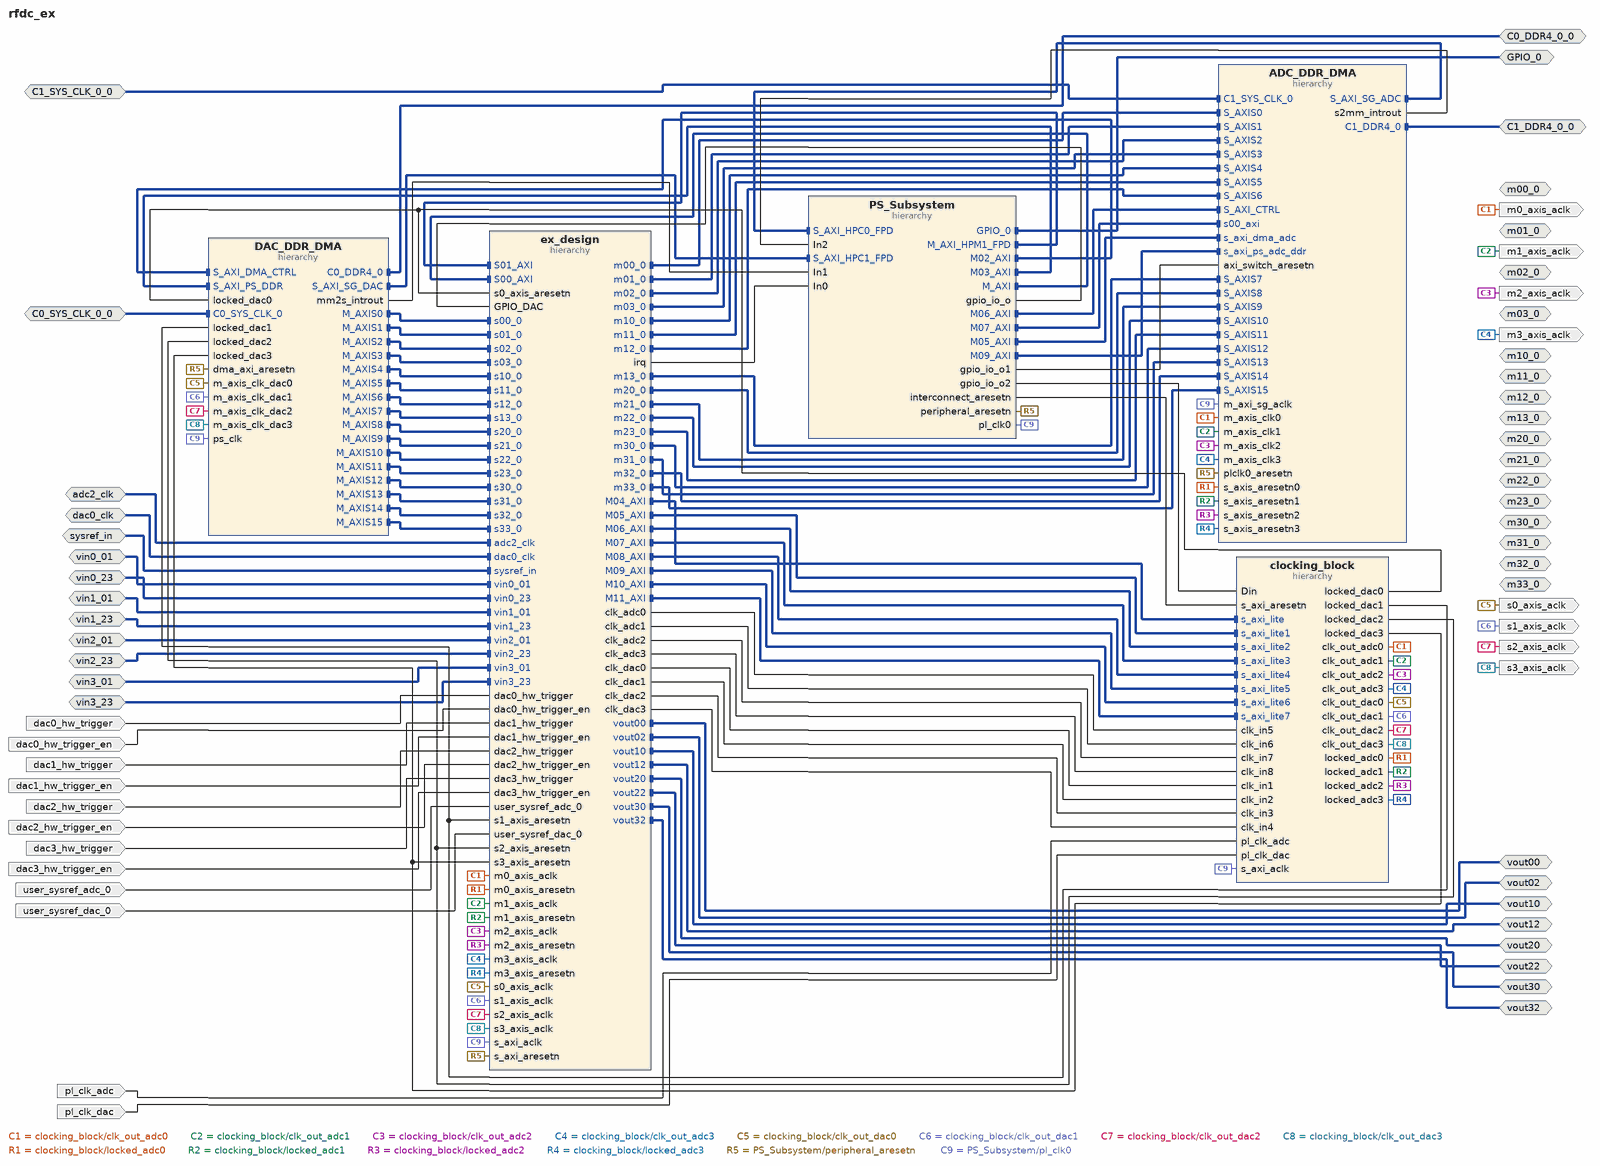
[diagram p0: block diagram of the top level]
# Vivado block design rfdc_ex, xczu48dr-fsvg1517-2-e, Vivado 2021.2
create_bd_design rfdc_ex

create_bd_intf_port -mode Slave -vlnv xilinx.com:display_usp_rf_data_converter:diff_pins_rtl:1.0 sysref_in
create_bd_intf_port -mode Slave -vlnv xilinx.com:interface:diff_clock_rtl:1.0 adc2_clk
set_property -dict {CONFIG.FREQ_HZ 245760000} [get_bd_intf_ports adc2_clk]
create_bd_intf_port -mode Slave -vlnv xilinx.com:interface:diff_clock_rtl:1.0 dac0_clk
set_property -dict {CONFIG.FREQ_HZ 245760000} [get_bd_intf_ports dac0_clk]
create_bd_intf_port -mode Slave -vlnv xilinx.com:interface:diff_analog_io_rtl:1.0 vin0_01
create_bd_intf_port -mode Slave -vlnv xilinx.com:interface:diff_analog_io_rtl:1.0 vin0_23
create_bd_intf_port -mode Slave -vlnv xilinx.com:interface:diff_analog_io_rtl:1.0 vin1_01
create_bd_intf_port -mode Slave -vlnv xilinx.com:interface:diff_analog_io_rtl:1.0 vin1_23
create_bd_intf_port -mode Slave -vlnv xilinx.com:interface:diff_analog_io_rtl:1.0 vin2_01
create_bd_intf_port -mode Slave -vlnv xilinx.com:interface:diff_analog_io_rtl:1.0 vin2_23
create_bd_intf_port -mode Slave -vlnv xilinx.com:interface:diff_analog_io_rtl:1.0 vin3_01
create_bd_intf_port -mode Slave -vlnv xilinx.com:interface:diff_analog_io_rtl:1.0 vin3_23
create_bd_intf_port -mode Master -vlnv xilinx.com:interface:diff_analog_io_rtl:1.0 vout00
create_bd_intf_port -mode Master -vlnv xilinx.com:interface:diff_analog_io_rtl:1.0 vout02
create_bd_intf_port -mode Master -vlnv xilinx.com:interface:diff_analog_io_rtl:1.0 vout10
create_bd_intf_port -mode Master -vlnv xilinx.com:interface:diff_analog_io_rtl:1.0 vout12
create_bd_intf_port -mode Master -vlnv xilinx.com:interface:diff_analog_io_rtl:1.0 vout20
create_bd_intf_port -mode Master -vlnv xilinx.com:interface:diff_analog_io_rtl:1.0 vout22
create_bd_intf_port -mode Master -vlnv xilinx.com:interface:diff_analog_io_rtl:1.0 vout30
create_bd_intf_port -mode Master -vlnv xilinx.com:interface:diff_analog_io_rtl:1.0 vout32
create_bd_intf_port -mode Master -vlnv xilinx.com:interface:axis_rtl:1.0 m00_0
create_bd_intf_port -mode Master -vlnv xilinx.com:interface:axis_rtl:1.0 m01_0
create_bd_intf_port -mode Master -vlnv xilinx.com:interface:axis_rtl:1.0 m02_0
create_bd_intf_port -mode Master -vlnv xilinx.com:interface:axis_rtl:1.0 m03_0
create_bd_intf_port -mode Master -vlnv xilinx.com:interface:axis_rtl:1.0 m10_0
create_bd_intf_port -mode Master -vlnv xilinx.com:interface:axis_rtl:1.0 m11_0
create_bd_intf_port -mode Master -vlnv xilinx.com:interface:axis_rtl:1.0 m12_0
create_bd_intf_port -mode Master -vlnv xilinx.com:interface:axis_rtl:1.0 m13_0
create_bd_intf_port -mode Master -vlnv xilinx.com:interface:axis_rtl:1.0 m20_0
create_bd_intf_port -mode Master -vlnv xilinx.com:interface:axis_rtl:1.0 m21_0
create_bd_intf_port -mode Master -vlnv xilinx.com:interface:axis_rtl:1.0 m22_0
create_bd_intf_port -mode Master -vlnv xilinx.com:interface:axis_rtl:1.0 m23_0
create_bd_intf_port -mode Master -vlnv xilinx.com:interface:axis_rtl:1.0 m30_0
create_bd_intf_port -mode Master -vlnv xilinx.com:interface:axis_rtl:1.0 m31_0
create_bd_intf_port -mode Master -vlnv xilinx.com:interface:axis_rtl:1.0 m32_0
create_bd_intf_port -mode Master -vlnv xilinx.com:interface:axis_rtl:1.0 m33_0
create_bd_intf_port -mode Master -vlnv xilinx.com:interface:gpio_rtl:1.0 GPIO_0
create_bd_intf_port -mode Slave -vlnv xilinx.com:interface:diff_clock_rtl:1.0 C0_SYS_CLK_0_0
set_property -dict {CONFIG.FREQ_HZ 299940000} [get_bd_intf_ports C0_SYS_CLK_0_0]
create_bd_intf_port -mode Master -vlnv xilinx.com:interface:ddr4_rtl:1.0 C0_DDR4_0_0
create_bd_intf_port -mode Slave -vlnv xilinx.com:interface:diff_clock_rtl:1.0 C1_SYS_CLK_0_0
set_property -dict {CONFIG.FREQ_HZ 299940000} [get_bd_intf_ports C1_SYS_CLK_0_0]
create_bd_intf_port -mode Master -vlnv xilinx.com:interface:ddr4_rtl:1.0 C1_DDR4_0_0
create_bd_port -dir I dac0_hw_trigger
create_bd_port -dir I dac0_hw_trigger_en
create_bd_port -dir I dac1_hw_trigger
create_bd_port -dir I dac1_hw_trigger_en
create_bd_port -dir I dac2_hw_trigger
create_bd_port -dir I dac2_hw_trigger_en
create_bd_port -dir I dac3_hw_trigger
create_bd_port -dir I dac3_hw_trigger_en
create_bd_port -dir O -type clk s0_axis_aclk
create_bd_port -dir O -type clk s1_axis_aclk
create_bd_port -dir O -type clk s2_axis_aclk
create_bd_port -dir O -type clk s3_axis_aclk
create_bd_port -dir O -type clk m0_axis_aclk
set_property -dict {CONFIG.ASSOCIATED_BUSIF m00_0:m01_0:m02_0:m03_0} [get_bd_ports m0_axis_aclk]
create_bd_port -dir O -type clk m1_axis_aclk
set_property -dict {CONFIG.ASSOCIATED_BUSIF m10_0:m11_0:m12_0:m13_0} [get_bd_ports m1_axis_aclk]
create_bd_port -dir O -type clk m2_axis_aclk
set_property -dict {CONFIG.ASSOCIATED_BUSIF m20_0:m21_0:m22_0:m23_0} [get_bd_ports m2_axis_aclk]
create_bd_port -dir O -type clk m3_axis_aclk
set_property -dict {CONFIG.ASSOCIATED_BUSIF m30_0:m31_0:m32_0:m33_0} [get_bd_ports m3_axis_aclk]
create_bd_port -dir I pl_clk_dac
create_bd_port -dir I user_sysref_dac_0
create_bd_port -dir I pl_clk_adc
create_bd_port -dir I user_sysref_adc_0

create_bd_cell -type hier ex_design
create_bd_cell -type hier clocking_block
create_bd_cell -type hier PS_Subsystem
create_bd_cell -type hier DAC_DDR_DMA
create_bd_cell -type hier ADC_DDR_DMA

# ---- hierarchy /ex_design ----
current_bd_instance /ex_design
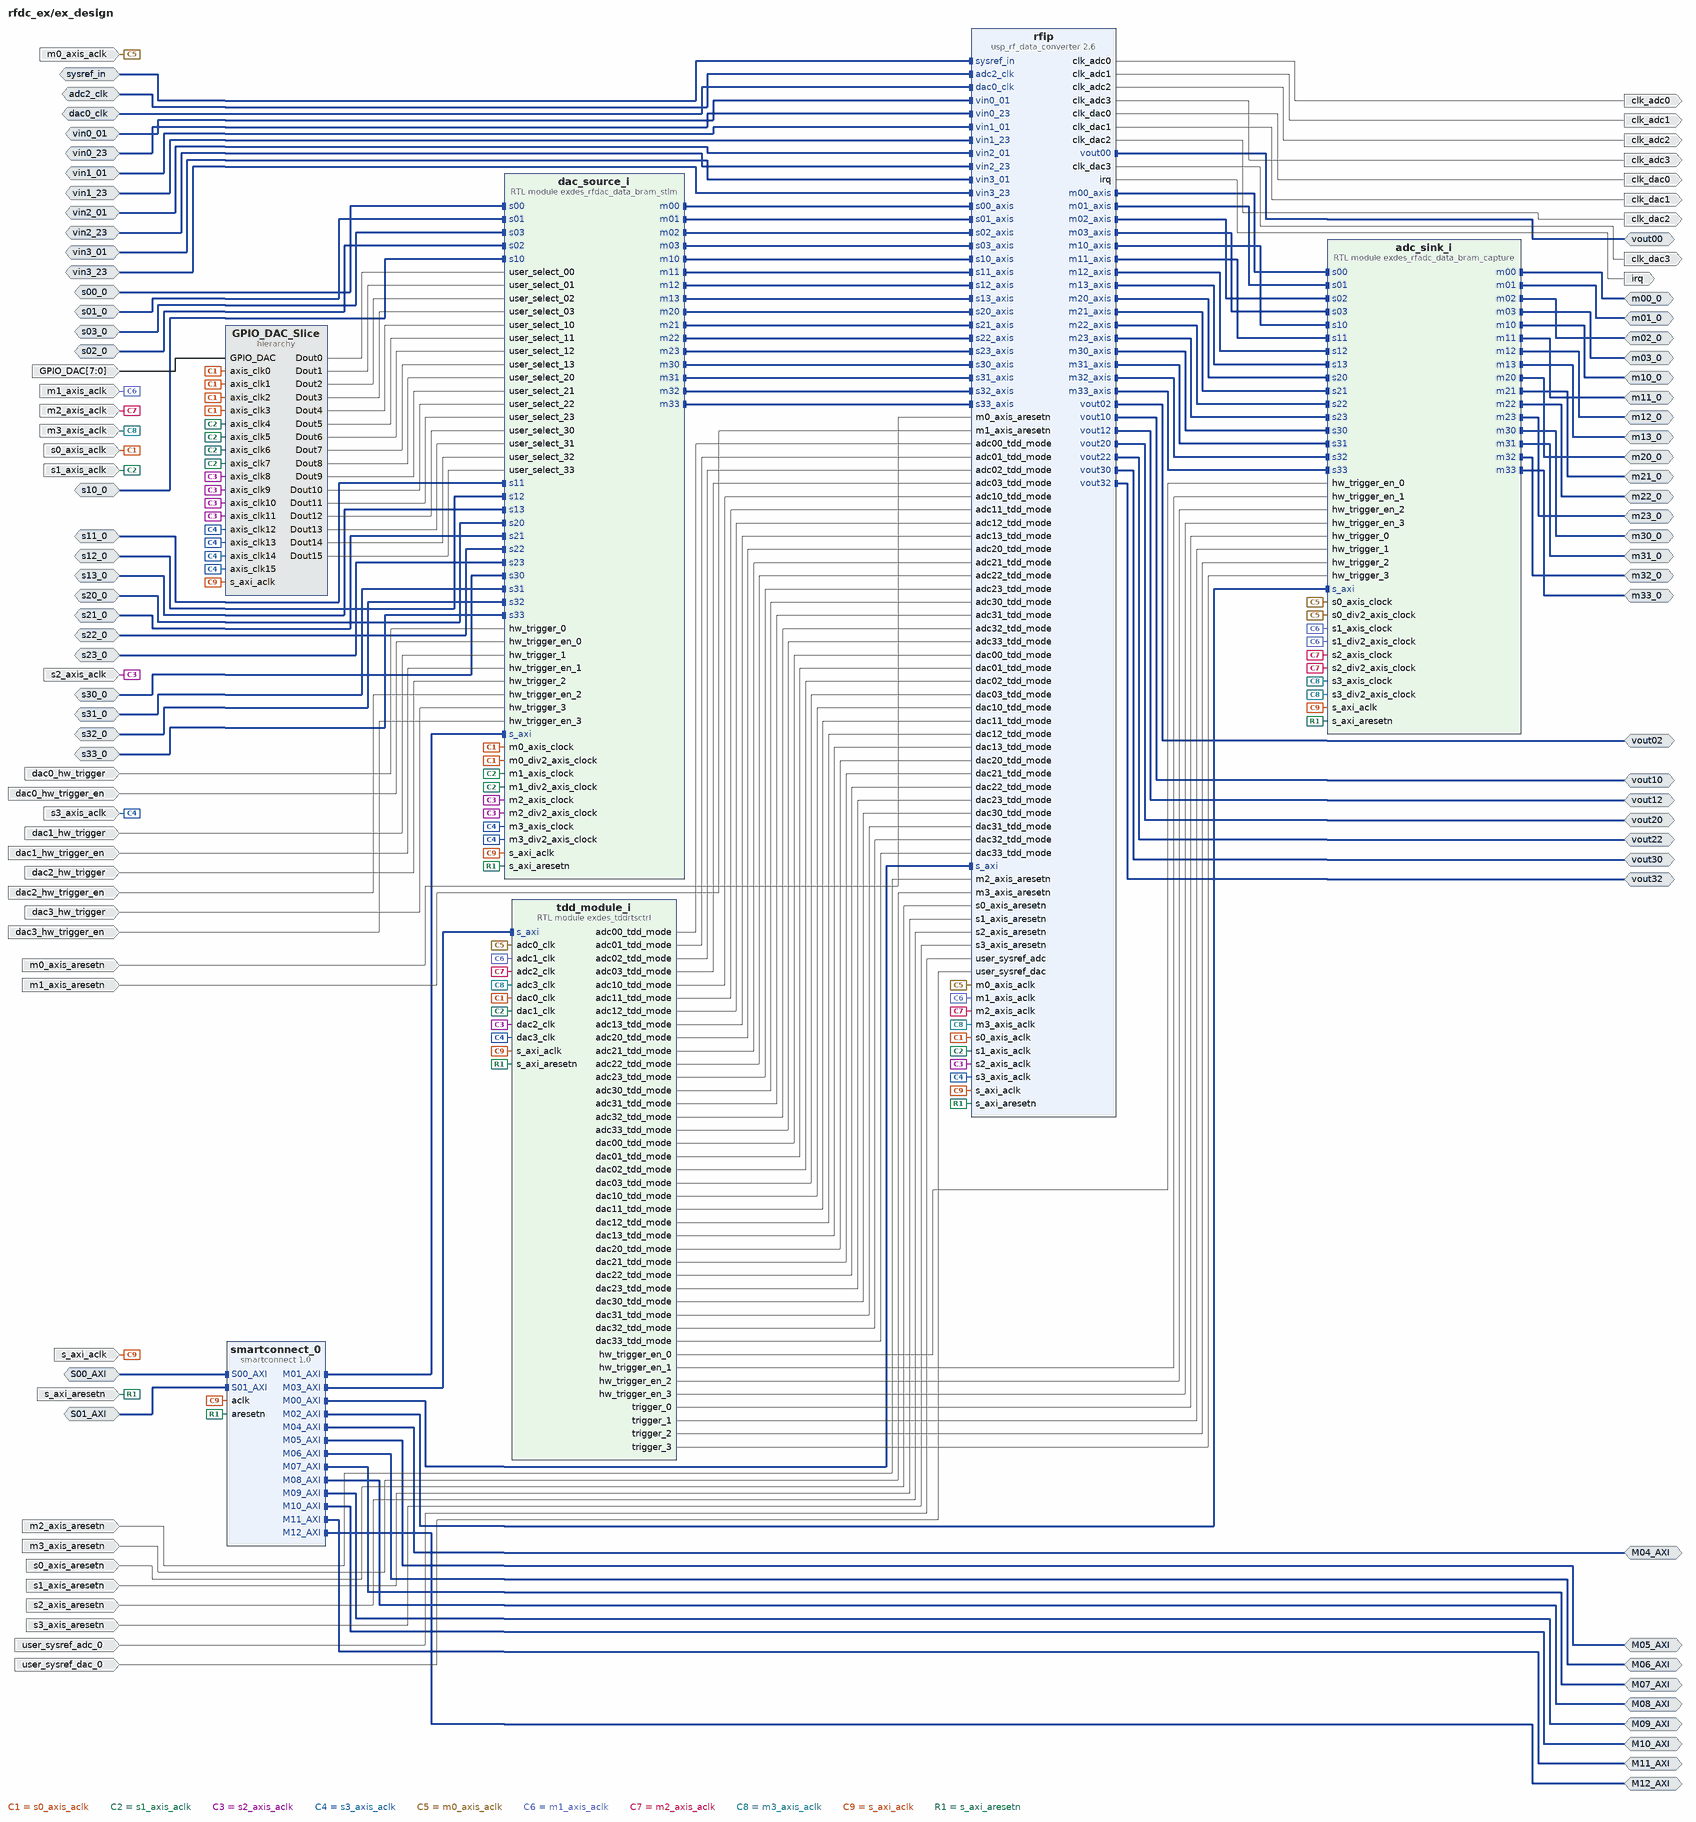
[diagram p1: block diagram inside /ex_design]
create_bd_intf_pin -mode Master -vlnv xilinx.com:interface:axis_rtl:1.0 m00_0
create_bd_intf_pin -mode Master -vlnv xilinx.com:interface:axis_rtl:1.0 m01_0
create_bd_intf_pin -mode Master -vlnv xilinx.com:interface:axis_rtl:1.0 m02_0
create_bd_intf_pin -mode Master -vlnv xilinx.com:interface:axis_rtl:1.0 m03_0
create_bd_intf_pin -mode Master -vlnv xilinx.com:interface:axis_rtl:1.0 m10_0
create_bd_intf_pin -mode Master -vlnv xilinx.com:interface:axis_rtl:1.0 m11_0
create_bd_intf_pin -mode Master -vlnv xilinx.com:interface:axis_rtl:1.0 m12_0
create_bd_intf_pin -mode Master -vlnv xilinx.com:interface:axis_rtl:1.0 m13_0
create_bd_intf_pin -mode Master -vlnv xilinx.com:interface:axis_rtl:1.0 m20_0
create_bd_intf_pin -mode Master -vlnv xilinx.com:interface:axis_rtl:1.0 m21_0
create_bd_intf_pin -mode Master -vlnv xilinx.com:interface:axis_rtl:1.0 m22_0
create_bd_intf_pin -mode Master -vlnv xilinx.com:interface:axis_rtl:1.0 m23_0
create_bd_intf_pin -mode Master -vlnv xilinx.com:interface:axis_rtl:1.0 m30_0
create_bd_intf_pin -mode Master -vlnv xilinx.com:interface:axis_rtl:1.0 m31_0
create_bd_intf_pin -mode Master -vlnv xilinx.com:interface:axis_rtl:1.0 m32_0
create_bd_intf_pin -mode Master -vlnv xilinx.com:interface:axis_rtl:1.0 m33_0
create_bd_intf_pin -mode Slave -vlnv xilinx.com:interface:axis_rtl:1.0 s00_0
create_bd_intf_pin -mode Slave -vlnv xilinx.com:interface:axis_rtl:1.0 s01_0
create_bd_intf_pin -mode Slave -vlnv xilinx.com:interface:axis_rtl:1.0 s03_0
create_bd_intf_pin -mode Slave -vlnv xilinx.com:interface:axis_rtl:1.0 s02_0
create_bd_intf_pin -mode Slave -vlnv xilinx.com:interface:axis_rtl:1.0 s10_0
create_bd_intf_pin -mode Slave -vlnv xilinx.com:interface:axis_rtl:1.0 s11_0
create_bd_intf_pin -mode Slave -vlnv xilinx.com:interface:axis_rtl:1.0 s12_0
create_bd_intf_pin -mode Slave -vlnv xilinx.com:interface:axis_rtl:1.0 s13_0
create_bd_intf_pin -mode Slave -vlnv xilinx.com:interface:axis_rtl:1.0 s20_0
create_bd_intf_pin -mode Slave -vlnv xilinx.com:interface:axis_rtl:1.0 s21_0
create_bd_intf_pin -mode Slave -vlnv xilinx.com:interface:axis_rtl:1.0 s22_0
create_bd_intf_pin -mode Slave -vlnv xilinx.com:interface:axis_rtl:1.0 s23_0
create_bd_intf_pin -mode Slave -vlnv xilinx.com:interface:axis_rtl:1.0 s30_0
create_bd_intf_pin -mode Slave -vlnv xilinx.com:interface:axis_rtl:1.0 s31_0
create_bd_intf_pin -mode Slave -vlnv xilinx.com:interface:axis_rtl:1.0 s32_0
create_bd_intf_pin -mode Slave -vlnv xilinx.com:interface:axis_rtl:1.0 s33_0
create_bd_intf_pin -mode Slave -vlnv xilinx.com:display_usp_rf_data_converter:diff_pins_rtl:1.0 sysref_in
create_bd_intf_pin -mode Slave -vlnv xilinx.com:interface:diff_clock_rtl:1.0 adc2_clk
create_bd_intf_pin -mode Slave -vlnv xilinx.com:interface:diff_clock_rtl:1.0 dac0_clk
create_bd_intf_pin -mode Slave -vlnv xilinx.com:interface:diff_analog_io_rtl:1.0 vin0_01
create_bd_intf_pin -mode Slave -vlnv xilinx.com:interface:diff_analog_io_rtl:1.0 vin0_23
create_bd_intf_pin -mode Slave -vlnv xilinx.com:interface:diff_analog_io_rtl:1.0 vin1_01
create_bd_intf_pin -mode Slave -vlnv xilinx.com:interface:diff_analog_io_rtl:1.0 vin1_23
create_bd_intf_pin -mode Slave -vlnv xilinx.com:interface:diff_analog_io_rtl:1.0 vin2_01
create_bd_intf_pin -mode Slave -vlnv xilinx.com:interface:diff_analog_io_rtl:1.0 vin2_23
create_bd_intf_pin -mode Slave -vlnv xilinx.com:interface:diff_analog_io_rtl:1.0 vin3_01
create_bd_intf_pin -mode Slave -vlnv xilinx.com:interface:diff_analog_io_rtl:1.0 vin3_23
create_bd_intf_pin -mode Master -vlnv xilinx.com:interface:diff_analog_io_rtl:1.0 vout00
create_bd_intf_pin -mode Master -vlnv xilinx.com:interface:diff_analog_io_rtl:1.0 vout02
create_bd_intf_pin -mode Master -vlnv xilinx.com:interface:diff_analog_io_rtl:1.0 vout10
create_bd_intf_pin -mode Master -vlnv xilinx.com:interface:diff_analog_io_rtl:1.0 vout12
create_bd_intf_pin -mode Master -vlnv xilinx.com:interface:diff_analog_io_rtl:1.0 vout20
create_bd_intf_pin -mode Master -vlnv xilinx.com:interface:diff_analog_io_rtl:1.0 vout22
create_bd_intf_pin -mode Master -vlnv xilinx.com:interface:diff_analog_io_rtl:1.0 vout30
create_bd_intf_pin -mode Master -vlnv xilinx.com:interface:diff_analog_io_rtl:1.0 vout32
create_bd_intf_pin -mode Master -vlnv xilinx.com:interface:aximm_rtl:1.0 M04_AXI
create_bd_intf_pin -mode Master -vlnv xilinx.com:interface:aximm_rtl:1.0 M05_AXI
create_bd_intf_pin -mode Master -vlnv xilinx.com:interface:aximm_rtl:1.0 M06_AXI
create_bd_intf_pin -mode Master -vlnv xilinx.com:interface:aximm_rtl:1.0 M07_AXI
create_bd_intf_pin -mode Master -vlnv xilinx.com:interface:aximm_rtl:1.0 M08_AXI
create_bd_intf_pin -mode Master -vlnv xilinx.com:interface:aximm_rtl:1.0 M09_AXI
create_bd_intf_pin -mode Master -vlnv xilinx.com:interface:aximm_rtl:1.0 M10_AXI
create_bd_intf_pin -mode Master -vlnv xilinx.com:interface:aximm_rtl:1.0 M11_AXI
create_bd_intf_pin -mode Slave -vlnv xilinx.com:interface:aximm_rtl:1.0 S00_AXI
create_bd_intf_pin -mode Slave -vlnv xilinx.com:interface:aximm_rtl:1.0 S01_AXI
create_bd_intf_pin -mode Master -vlnv xilinx.com:interface:aximm_rtl:1.0 M12_AXI
create_bd_pin -dir I -type clk s_axi_aclk
create_bd_pin -dir I -type rst s_axi_aresetn
create_bd_pin -dir I dac0_hw_trigger_en
create_bd_pin -dir I dac3_hw_trigger_en
create_bd_pin -dir I dac1_hw_trigger_en
create_bd_pin -dir I dac1_hw_trigger
create_bd_pin -dir I dac2_hw_trigger_en
create_bd_pin -dir I dac3_hw_trigger
create_bd_pin -dir I dac0_hw_trigger
create_bd_pin -dir I dac2_hw_trigger
create_bd_pin -dir O -type clk clk_dac0
create_bd_pin -dir I -type clk s0_axis_aclk
create_bd_pin -dir I -type rst s0_axis_aresetn
create_bd_pin -dir O -type clk clk_dac1
create_bd_pin -dir I -type clk s1_axis_aclk
create_bd_pin -dir I -type rst s1_axis_aresetn
create_bd_pin -dir O -type clk clk_dac2
create_bd_pin -dir I -type clk s2_axis_aclk
create_bd_pin -dir I -type rst s2_axis_aresetn
create_bd_pin -dir O -type clk clk_dac3
create_bd_pin -dir I -type clk s3_axis_aclk
create_bd_pin -dir I -type rst s3_axis_aresetn
create_bd_pin -dir O -type clk clk_adc0
create_bd_pin -dir I -type clk m0_axis_aclk
create_bd_pin -dir I -type rst m0_axis_aresetn
create_bd_pin -dir O -type clk clk_adc1
create_bd_pin -dir I -type clk m1_axis_aclk
create_bd_pin -dir I -type rst m1_axis_aresetn
create_bd_pin -dir O -type clk clk_adc2
create_bd_pin -dir I -type clk m2_axis_aclk
create_bd_pin -dir I -type rst m2_axis_aresetn
create_bd_pin -dir O -type clk clk_adc3
create_bd_pin -dir I -type clk m3_axis_aclk
create_bd_pin -dir I -type rst m3_axis_aresetn
create_bd_pin -dir O -type intr irq
create_bd_pin -dir I -from 7 -to 0 GPIO_DAC
create_bd_pin -dir I user_sysref_dac_0
create_bd_pin -dir I user_sysref_adc_0

create_bd_cell -type ip -vlnv xilinx.com:ip:smartconnect:1.0 smartconnect_0
set_property -dict {CONFIG.NUM_MI 13 CONFIG.NUM_SI 2} [get_bd_cells smartconnect_0]
create_bd_cell -type module -reference exdes_rfadc_data_bram_capture adc_sink_i
set_property -dict [list \
  CONFIG.axi_addr_top 19 \
  CONFIG.mem_size 262144 \
  CONFIG.use_div2_clk_0 0 \
  CONFIG.use_div2_clk_1 0 \
  CONFIG.use_div2_clk_2 0 \
  CONFIG.use_div2_clk_3 0 \
] [get_bd_cells adc_sink_i]
create_bd_cell -type module -reference exdes_rfdac_data_bram_stim dac_source_i
set_property -dict [list \
  CONFIG.axi_addr_top 19 \
  CONFIG.mem_size 262144 \
  CONFIG.use_div2_clk_0 0 \
  CONFIG.use_div2_clk_1 0 \
  CONFIG.use_div2_clk_2 0 \
  CONFIG.use_div2_clk_3 0 \
] [get_bd_cells dac_source_i]
create_bd_cell -type module -reference exdes_tddrtsctrl tdd_module_i
create_bd_cell -type ip -vlnv xilinx.com:ip:usp_rf_data_converter:2.6 rfip
set_property -dict [list \
  CONFIG.ADC0_Band 0 \
  CONFIG.ADC0_Clock_Dist 0 \
  CONFIG.ADC0_Clock_Source 2 \
  CONFIG.ADC0_Link_Coupling 0 \
  CONFIG.ADC0_Multi_Tile_Sync true \
  CONFIG.ADC0_Outclk_Freq 276.480 \
  CONFIG.ADC0_PLL_Enable true \
  CONFIG.ADC0_Refclk_Div 1 \
  CONFIG.ADC0_Refclk_Freq 245.760 \
  CONFIG.ADC0_Sampling_Rate 4.42368 \
  CONFIG.ADC1_Band 0 \
  CONFIG.ADC1_Clock_Dist 0 \
  CONFIG.ADC1_Clock_Source 2 \
  CONFIG.ADC1_Link_Coupling 0 \
  CONFIG.ADC1_Multi_Tile_Sync true \
  CONFIG.ADC1_Outclk_Freq 276.480 \
  CONFIG.ADC1_PLL_Enable true \
  CONFIG.ADC1_Refclk_Div 1 \
  CONFIG.ADC1_Refclk_Freq 245.760 \
  CONFIG.ADC1_Sampling_Rate 4.42368 \
  CONFIG.ADC224_En false \
  CONFIG.ADC225_En false \
  CONFIG.ADC226_En false \
  CONFIG.ADC227_En false \
  CONFIG.ADC2_Band 0 \
  CONFIG.ADC2_Clock_Dist 1 \
  CONFIG.ADC2_Clock_Source 2 \
  CONFIG.ADC2_Link_Coupling 0 \
  CONFIG.ADC2_Multi_Tile_Sync true \
  CONFIG.ADC2_Outclk_Freq 276.480 \
  CONFIG.ADC2_PLL_Enable true \
  CONFIG.ADC2_Refclk_Div 1 \
  CONFIG.ADC2_Refclk_Freq 245.760 \
  CONFIG.ADC2_Sampling_Rate 4.42368 \
  CONFIG.ADC3_Band 0 \
  CONFIG.ADC3_Clock_Dist 0 \
  CONFIG.ADC3_Clock_Source 2 \
  CONFIG.ADC3_Link_Coupling 0 \
  CONFIG.ADC3_Multi_Tile_Sync true \
  CONFIG.ADC3_Outclk_Freq 276.480 \
  CONFIG.ADC3_PLL_Enable true \
  CONFIG.ADC3_Refclk_Div 1 \
  CONFIG.ADC3_Refclk_Freq 245.760 \
  CONFIG.ADC3_Sampling_Rate 4.42368 \
  CONFIG.ADC_CalOpt_Mode00 2 \
  CONFIG.ADC_CalOpt_Mode02 2 \
  CONFIG.ADC_CalOpt_Mode10 2 \
  CONFIG.ADC_CalOpt_Mode12 2 \
  CONFIG.ADC_CalOpt_Mode20 2 \
  CONFIG.ADC_CalOpt_Mode22 2 \
  CONFIG.ADC_CalOpt_Mode30 2 \
  CONFIG.ADC_CalOpt_Mode32 2 \
  CONFIG.ADC_DSA_RTS false \
  CONFIG.ADC_Data_Type00 1 \
  CONFIG.ADC_Data_Type02 1 \
  CONFIG.ADC_Data_Type10 1 \
  CONFIG.ADC_Data_Type12 1 \
  CONFIG.ADC_Data_Type20 1 \
  CONFIG.ADC_Data_Type22 1 \
  CONFIG.ADC_Data_Type30 1 \
  CONFIG.ADC_Data_Type32 1 \
  CONFIG.ADC_Data_Width00 12 \
  CONFIG.ADC_Data_Width02 12 \
  CONFIG.ADC_Data_Width10 12 \
  CONFIG.ADC_Data_Width12 12 \
  CONFIG.ADC_Data_Width20 12 \
  CONFIG.ADC_Data_Width22 12 \
  CONFIG.ADC_Data_Width30 12 \
  CONFIG.ADC_Data_Width32 12 \
  CONFIG.ADC_Debug false \
  CONFIG.ADC_Decimation_Mode00 1 \
  CONFIG.ADC_Decimation_Mode02 1 \
  CONFIG.ADC_Decimation_Mode10 1 \
  CONFIG.ADC_Decimation_Mode12 1 \
  CONFIG.ADC_Decimation_Mode20 1 \
  CONFIG.ADC_Decimation_Mode22 1 \
  CONFIG.ADC_Decimation_Mode30 1 \
  CONFIG.ADC_Decimation_Mode32 1 \
  CONFIG.ADC_Dither00 true \
  CONFIG.ADC_Dither02 true \
  CONFIG.ADC_Dither10 true \
  CONFIG.ADC_Dither12 true \
  CONFIG.ADC_Dither20 true \
  CONFIG.ADC_Dither22 true \
  CONFIG.ADC_Dither30 true \
  CONFIG.ADC_Dither32 true \
  CONFIG.ADC_Mixer_Mode00 0 \
  CONFIG.ADC_Mixer_Mode02 0 \
  CONFIG.ADC_Mixer_Mode10 0 \
  CONFIG.ADC_Mixer_Mode12 0 \
  CONFIG.ADC_Mixer_Mode20 0 \
  CONFIG.ADC_Mixer_Mode22 0 \
  CONFIG.ADC_Mixer_Mode30 0 \
  CONFIG.ADC_Mixer_Mode32 0 \
  CONFIG.ADC_Mixer_Type00 2 \
  CONFIG.ADC_Mixer_Type01 2 \
  CONFIG.ADC_Mixer_Type02 2 \
  CONFIG.ADC_Mixer_Type03 2 \
  CONFIG.ADC_Mixer_Type10 2 \
  CONFIG.ADC_Mixer_Type11 2 \
  CONFIG.ADC_Mixer_Type12 2 \
  CONFIG.ADC_Mixer_Type13 2 \
  CONFIG.ADC_Mixer_Type20 2 \
  CONFIG.ADC_Mixer_Type21 2 \
  CONFIG.ADC_Mixer_Type22 2 \
  CONFIG.ADC_Mixer_Type23 2 \
  CONFIG.ADC_Mixer_Type30 2 \
  CONFIG.ADC_Mixer_Type31 2 \
  CONFIG.ADC_Mixer_Type32 2 \
  CONFIG.ADC_Mixer_Type33 2 \
  CONFIG.ADC_NCO_Freq00 0 \
  CONFIG.ADC_NCO_Freq02 0 \
  CONFIG.ADC_NCO_Freq10 0 \
  CONFIG.ADC_NCO_Freq12 0 \
  CONFIG.ADC_NCO_Freq20 0 \
  CONFIG.ADC_NCO_Freq22 0 \
  CONFIG.ADC_NCO_Freq30 0 \
  CONFIG.ADC_NCO_Freq32 0 \
  CONFIG.ADC_NCO_Phase00 0 \
  CONFIG.ADC_NCO_Phase02 0 \
  CONFIG.ADC_NCO_Phase10 0 \
  CONFIG.ADC_NCO_Phase12 0 \
  CONFIG.ADC_NCO_Phase20 0 \
  CONFIG.ADC_NCO_Phase22 0 \
  CONFIG.ADC_NCO_Phase30 0 \
  CONFIG.ADC_NCO_Phase32 0 \
  CONFIG.ADC_NCO_RTS false \
  CONFIG.ADC_Neg_Quadrature00 false \
  CONFIG.ADC_Neg_Quadrature02 false \
  CONFIG.ADC_Neg_Quadrature10 false \
  CONFIG.ADC_Neg_Quadrature12 false \
  CONFIG.ADC_Neg_Quadrature20 false \
  CONFIG.ADC_Neg_Quadrature22 false \
  CONFIG.ADC_Neg_Quadrature30 false \
  CONFIG.ADC_Neg_Quadrature32 false \
  CONFIG.ADC_Nyquist00 0 \
  CONFIG.ADC_Nyquist02 0 \
  CONFIG.ADC_Nyquist10 0 \
  CONFIG.ADC_Nyquist12 0 \
  CONFIG.ADC_Nyquist20 0 \
  CONFIG.ADC_Nyquist22 0 \
  CONFIG.ADC_Nyquist30 0 \
  CONFIG.ADC_Nyquist32 0 \
  CONFIG.ADC_OBS00 false \
  CONFIG.ADC_OBS02 false \
  CONFIG.ADC_OBS10 false \
  CONFIG.ADC_OBS12 false \
  CONFIG.ADC_OBS20 false \
  CONFIG.ADC_OBS22 false \
  CONFIG.ADC_OBS30 false \
  CONFIG.ADC_OBS32 false \
  CONFIG.ADC_RTS false \
  CONFIG.ADC_Slice00_Enable true \
  CONFIG.ADC_Slice02_Enable true \
  CONFIG.ADC_Slice10_Enable true \
  CONFIG.ADC_Slice12_Enable true \
  CONFIG.ADC_Slice20_Enable true \
  CONFIG.ADC_Slice22_Enable true \
  CONFIG.ADC_Slice30_Enable true \
  CONFIG.ADC_Slice32_Enable true \
  CONFIG.ADC_TDD_RTS00 1 \
  CONFIG.ADC_TDD_RTS02 1 \
  CONFIG.ADC_TDD_RTS10 1 \
  CONFIG.ADC_TDD_RTS12 1 \
  CONFIG.ADC_TDD_RTS20 1 \
  CONFIG.ADC_TDD_RTS22 1 \
  CONFIG.ADC_TDD_RTS30 1 \
  CONFIG.ADC_TDD_RTS32 1 \
  CONFIG.AMS_Factory_Var 0 \
  CONFIG.Analog_Detection 1 \
  CONFIG.Axiclk_Freq 57.5 \
  CONFIG.Calibration_Freeze false \
  CONFIG.Calibration_Time 10 \
  CONFIG.Clock_Forwarding false \
  CONFIG.Converter_Setup 1 \
  CONFIG.DAC0_Band 3 \
  CONFIG.DAC0_Clock_Dist 1 \
  CONFIG.DAC0_Clock_Source 4 \
  CONFIG.DAC0_Link_Coupling 0 \
  CONFIG.DAC0_Multi_Tile_Sync true \
  CONFIG.DAC0_Outclk_Freq 491.520 \
  CONFIG.DAC0_PLL_Enable true \
  CONFIG.DAC0_Refclk_Div 1 \
  CONFIG.DAC0_Refclk_Freq 245.760 \
  CONFIG.DAC0_Sampling_Rate 7.86432 \
  CONFIG.DAC0_VOP 32.0 \
  CONFIG.DAC1_Band 3 \
  CONFIG.DAC1_Clock_Source 4 \
  CONFIG.DAC1_Link_Coupling 0 \
  CONFIG.DAC1_Multi_Tile_Sync true \
  CONFIG.DAC1_Outclk_Freq 491.520 \
  CONFIG.DAC1_PLL_Enable true \
  CONFIG.DAC1_Refclk_Div 1 \
  CONFIG.DAC1_Refclk_Freq 245.760 \
  CONFIG.DAC1_Sampling_Rate 7.86432 \
  CONFIG.DAC1_VOP 32.0 \
  CONFIG.DAC228_En false \
  CONFIG.DAC229_En false \
  CONFIG.DAC230_En false \
  CONFIG.DAC231_En false \
  CONFIG.DAC2_Band 3 \
  CONFIG.DAC2_Clock_Dist 0 \
  CONFIG.DAC2_Clock_Source 4 \
  CONFIG.DAC2_Link_Coupling 0 \
  CONFIG.DAC2_Multi_Tile_Sync true \
  CONFIG.DAC2_Outclk_Freq 491.520 \
  CONFIG.DAC2_PLL_Enable true \
  CONFIG.DAC2_Refclk_Div 1 \
  CONFIG.DAC2_Refclk_Freq 245.760 \
  CONFIG.DAC2_Sampling_Rate 7.86432 \
  CONFIG.DAC2_VOP 32.0 \
  CONFIG.DAC3_Band 3 \
  CONFIG.DAC3_Clock_Source 4 \
  CONFIG.DAC3_Link_Coupling 0 \
  CONFIG.DAC3_Multi_Tile_Sync true \
  CONFIG.DAC3_Outclk_Freq 491.520 \
  CONFIG.DAC3_PLL_Enable true \
  CONFIG.DAC3_Refclk_Div 1 \
  CONFIG.DAC3_Refclk_Freq 245.760 \
  CONFIG.DAC3_Sampling_Rate 7.86432 \
  CONFIG.DAC3_VOP 32.0 \
  CONFIG.DAC_Data_Type00 0 \
  CONFIG.DAC_Data_Type02 0 \
  CONFIG.DAC_Data_Type10 0 \
  CONFIG.DAC_Data_Type12 0 \
  CONFIG.DAC_Data_Type20 0 \
  CONFIG.DAC_Data_Type22 0 \
  CONFIG.DAC_Data_Type30 0 \
  CONFIG.DAC_Data_Type32 0 \
  CONFIG.DAC_Data_Width00 16 \
  CONFIG.DAC_Data_Width01 16 \
  CONFIG.DAC_Data_Width02 16 \
  CONFIG.DAC_Data_Width03 16 \
  CONFIG.DAC_Data_Width10 16 \
  CONFIG.DAC_Data_Width11 16 \
  CONFIG.DAC_Data_Width12 16 \
  CONFIG.DAC_Data_Width13 16 \
  CONFIG.DAC_Data_Width20 16 \
  CONFIG.DAC_Data_Width21 16 \
  CONFIG.DAC_Data_Width22 16 \
  CONFIG.DAC_Data_Width23 16 \
  CONFIG.DAC_Data_Width30 16 \
  CONFIG.DAC_Data_Width31 16 \
  CONFIG.DAC_Data_Width32 16 \
  CONFIG.DAC_Data_Width33 16 \
  CONFIG.DAC_Debug false \
  CONFIG.DAC_Decoder_Mode00 0 \
  CONFIG.DAC_Decoder_Mode02 0 \
  CONFIG.DAC_Decoder_Mode10 0 \
  CONFIG.DAC_Decoder_Mode12 0 \
  CONFIG.DAC_Decoder_Mode20 0 \
  CONFIG.DAC_Decoder_Mode22 0 \
  CONFIG.DAC_Decoder_Mode30 0 \
  CONFIG.DAC_Decoder_Mode32 0 \
  CONFIG.DAC_Interpolation_Mode00 2 \
  CONFIG.DAC_Interpolation_Mode01 2 \
  CONFIG.DAC_Interpolation_Mode02 2 \
  CONFIG.DAC_Interpolation_Mode03 2 \
  CONFIG.DAC_Interpolation_Mode10 2 \
  CONFIG.DAC_Interpolation_Mode11 2 \
  CONFIG.DAC_Interpolation_Mode12 2 \
  CONFIG.DAC_Interpolation_Mode13 2 \
  CONFIG.DAC_Interpolation_Mode20 2 \
  CONFIG.DAC_Interpolation_Mode21 2 \
  CONFIG.DAC_Interpolation_Mode22 2 \
  CONFIG.DAC_Interpolation_Mode23 2 \
  CONFIG.DAC_Interpolation_Mode30 2 \
  CONFIG.DAC_Interpolation_Mode31 2 \
  CONFIG.DAC_Interpolation_Mode32 2 \
  CONFIG.DAC_Interpolation_Mode33 2 \
  CONFIG.DAC_Invsinc_Ctrl00 false \
  CONFIG.DAC_Invsinc_Ctrl02 false \
  CONFIG.DAC_Invsinc_Ctrl10 false \
  CONFIG.DAC_Invsinc_Ctrl12 false \
  CONFIG.DAC_Invsinc_Ctrl20 false \
  CONFIG.DAC_Invsinc_Ctrl22 false \
  CONFIG.DAC_Invsinc_Ctrl30 false \
  CONFIG.DAC_Invsinc_Ctrl32 false \
  CONFIG.DAC_Mixer_Mode00 0 \
  CONFIG.DAC_Mixer_Mode01 0 \
  CONFIG.DAC_Mixer_Mode02 0 \
  CONFIG.DAC_Mixer_Mode03 0 \
  CONFIG.DAC_Mixer_Mode10 0 \
  CONFIG.DAC_Mixer_Mode11 0 \
  CONFIG.DAC_Mixer_Mode12 0 \
  CONFIG.DAC_Mixer_Mode13 0 \
  CONFIG.DAC_Mixer_Mode20 0 \
  CONFIG.DAC_Mixer_Mode21 0 \
  CONFIG.DAC_Mixer_Mode22 0 \
  CONFIG.DAC_Mixer_Mode23 0 \
  CONFIG.DAC_Mixer_Mode30 0 \
  CONFIG.DAC_Mixer_Mode31 0 \
  CONFIG.DAC_Mixer_Mode32 0 \
  CONFIG.DAC_Mixer_Mode33 0 \
  CONFIG.DAC_Mixer_Type00 2 \
  CONFIG.DAC_Mixer_Type01 2 \
  CONFIG.DAC_Mixer_Type02 2 \
  CONFIG.DAC_Mixer_Type03 2 \
  CONFIG.DAC_Mixer_Type10 2 \
  CONFIG.DAC_Mixer_Type11 2 \
  CONFIG.DAC_Mixer_Type12 2 \
  CONFIG.DAC_Mixer_Type13 2 \
  CONFIG.DAC_Mixer_Type20 2 \
  CONFIG.DAC_Mixer_Type21 2 \
  CONFIG.DAC_Mixer_Type22 2 \
  CONFIG.DAC_Mixer_Type23 2 \
  CONFIG.DAC_Mixer_Type30 2 \
  CONFIG.DAC_Mixer_Type31 2 \
  CONFIG.DAC_Mixer_Type32 2 \
  CONFIG.DAC_Mixer_Type33 2 \
  CONFIG.DAC_Mode00 1 \
  CONFIG.DAC_Mode02 1 \
  CONFIG.DAC_Mode10 1 \
  CONFIG.DAC_Mode12 1 \
  CONFIG.DAC_Mode20 1 \
  CONFIG.DAC_Mode22 1 \
  CONFIG.DAC_Mode30 1 \
  CONFIG.DAC_Mode32 1 \
  CONFIG.DAC_NCO_Freq00 0.0 \
  CONFIG.DAC_NCO_Freq01 0.0 \
  CONFIG.DAC_NCO_Freq02 0.0 \
  CONFIG.DAC_NCO_Freq03 0.0 \
  CONFIG.DAC_NCO_Freq10 0.0 \
  CONFIG.DAC_NCO_Freq11 0.0 \
  CONFIG.DAC_NCO_Freq12 0.0 \
  CONFIG.DAC_NCO_Freq13 0.0 \
  CONFIG.DAC_NCO_Freq20 0.0 \
  CONFIG.DAC_NCO_Freq21 0.0 \
  CONFIG.DAC_NCO_Freq22 0.0 \
  CONFIG.DAC_NCO_Freq23 0.0 \
  CONFIG.DAC_NCO_Freq30 0.0 \
  CONFIG.DAC_NCO_Freq31 0.0 \
  CONFIG.DAC_NCO_Freq32 0.0 \
  CONFIG.DAC_NCO_Freq33 0.0 \
  CONFIG.DAC_NCO_Phase00 0 \
  CONFIG.DAC_NCO_Phase01 0 \
  CONFIG.DAC_NCO_Phase02 0 \
  CONFIG.DAC_NCO_Phase03 0 \
  CONFIG.DAC_NCO_Phase10 0 \
  CONFIG.DAC_NCO_Phase11 0 \
  CONFIG.DAC_NCO_Phase12 0 \
  CONFIG.DAC_NCO_Phase13 0 \
  CONFIG.DAC_NCO_Phase20 0 \
  CONFIG.DAC_NCO_Phase21 0 \
  CONFIG.DAC_NCO_Phase22 0 \
  CONFIG.DAC_NCO_Phase23 0 \
  CONFIG.DAC_NCO_Phase30 0 \
  CONFIG.DAC_NCO_Phase31 0 \
  CONFIG.DAC_NCO_Phase32 0 \
  CONFIG.DAC_NCO_Phase33 0 \
  CONFIG.DAC_NCO_RTS false \
  CONFIG.DAC_Neg_Quadrature00 false \
  CONFIG.DAC_Neg_Quadrature01 false \
  CONFIG.DAC_Neg_Quadrature02 false \
  CONFIG.DAC_Neg_Quadrature03 false \
  CONFIG.DAC_Neg_Quadrature10 false \
  CONFIG.DAC_Neg_Quadrature11 false \
  CONFIG.DAC_Neg_Quadrature12 false \
  CONFIG.DAC_Neg_Quadrature13 false \
  CONFIG.DAC_Neg_Quadrature20 false \
  CONFIG.DAC_Neg_Quadrature21 false \
  CONFIG.DAC_Neg_Quadrature22 false \
  CONFIG.DAC_Neg_Quadrature23 false \
  CONFIG.DAC_Neg_Quadrature30 false \
  CONFIG.DAC_Neg_Quadrature31 false \
  CONFIG.DAC_Neg_Quadrature32 false \
  CONFIG.DAC_Neg_Quadrature33 false \
  CONFIG.DAC_Nyquist00 0 \
  CONFIG.DAC_Nyquist02 0 \
  CONFIG.DAC_Nyquist10 0 \
  CONFIG.DAC_Nyquist12 0 \
  CONFIG.DAC_Nyquist20 0 \
  CONFIG.DAC_Nyquist22 0 \
  CONFIG.DAC_Nyquist30 0 \
  CONFIG.DAC_Nyquist32 0 \
  CONFIG.DAC_RTS false \
  CONFIG.DAC_Slice00_Enable true \
  CONFIG.DAC_Slice02_Enable true \
  CONFIG.DAC_Slice10_Enable true \
  CONFIG.DAC_Slice12_Enable true \
  CONFIG.DAC_Slice20_Enable true \
  CONFIG.DAC_Slice22_Enable true \
  CONFIG.DAC_Slice30_Enable true \
  CONFIG.DAC_Slice32_Enable true \
  CONFIG.DAC_TDD_RTS00 1 \
  CONFIG.DAC_TDD_RTS01 1 \
  CONFIG.DAC_TDD_RTS02 1 \
  CONFIG.DAC_TDD_RTS03 1 \
  CONFIG.DAC_TDD_RTS10 1 \
  CONFIG.DAC_TDD_RTS11 1 \
  CONFIG.DAC_TDD_RTS12 1 \
  CONFIG.DAC_TDD_RTS13 1 \
  CONFIG.DAC_TDD_RTS20 1 \
  CONFIG.DAC_TDD_RTS21 1 \
  CONFIG.DAC_TDD_RTS22 1 \
  CONFIG.DAC_TDD_RTS23 1 \
  CONFIG.DAC_TDD_RTS30 1 \
  CONFIG.DAC_TDD_RTS31 1 \
  CONFIG.DAC_TDD_RTS32 1 \
  CONFIG.DAC_TDD_RTS33 1 \
  CONFIG.DAC_VOP_Mode 1 \
  CONFIG.DAC_VOP_RTS false \
  CONFIG.PL_Clock_Freq 122.880 \
  CONFIG.PRESET None \
  CONFIG.RESERVED_3 110000 \
  CONFIG.RF_Analyzer 1 \
  CONFIG.VNC_Include_Fs2_Change true \
  CONFIG.VNC_Include_OIS_Change true \
  CONFIG.VNC_Testing false \
  CONFIG.disable_bg_cal_en 1 \
  CONFIG.mADC_Band 0 \
  CONFIG.mADC_Mixer_Type01 3 \
  CONFIG.mADC_Mixer_Type03 3 \
  CONFIG.mDAC_Band 0 \
  CONFIG.mDAC_Slice00_Enable false \
  CONFIG.mDAC_Slice02_Enable false \
  CONFIG.mDAC_VOP 20.0 \
  CONFIG.production_simulation 0 \
  CONFIG.tb_adc_fft true \
  CONFIG.tb_dac_fft true \
  CONFIG.use_bram 1 \
] [get_bd_cells rfip]
create_bd_cell -type hier GPIO_DAC_Slice

# ---- hierarchy /ex_design/GPIO_DAC_Slice ----
current_bd_instance /ex_design/GPIO_DAC_Slice
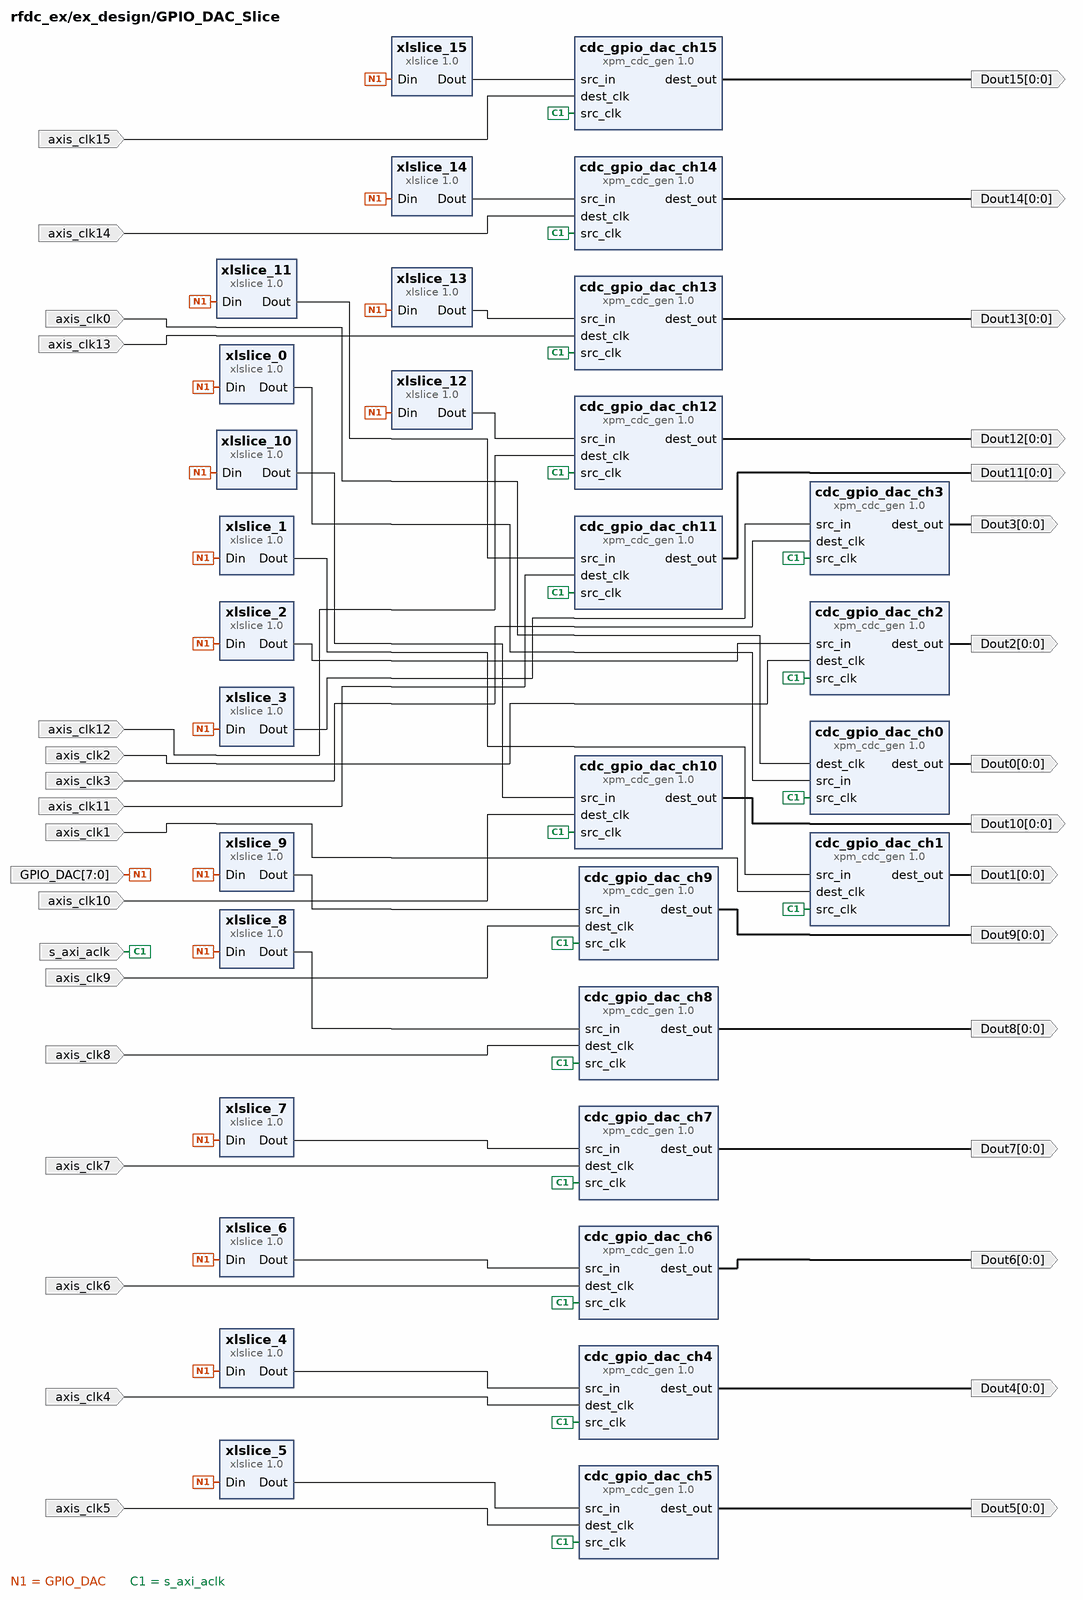
[diagram p2: block diagram inside /ex_design/GPIO_DAC_Slice]
create_bd_pin -dir I s_axi_aclk
create_bd_pin -dir O -from 0 -to 0 Dout0
create_bd_pin -dir O -from 0 -to 0 Dout1
create_bd_pin -dir O -from 0 -to 0 Dout2
create_bd_pin -dir O -from 0 -to 0 Dout3
create_bd_pin -dir O -from 0 -to 0 Dout4
create_bd_pin -dir O -from 0 -to 0 Dout5
create_bd_pin -dir O -from 0 -to 0 Dout6
create_bd_pin -dir O -from 0 -to 0 Dout7
create_bd_pin -dir O -from 0 -to 0 Dout8
create_bd_pin -dir O -from 0 -to 0 Dout9
create_bd_pin -dir O -from 0 -to 0 Dout10
create_bd_pin -dir O -from 0 -to 0 Dout11
create_bd_pin -dir O -from 0 -to 0 Dout12
create_bd_pin -dir O -from 0 -to 0 Dout13
create_bd_pin -dir O -from 0 -to 0 Dout14
create_bd_pin -dir O -from 0 -to 0 Dout15
create_bd_pin -dir I -from 7 -to 0 GPIO_DAC
create_bd_pin -dir I axis_clk0
create_bd_pin -dir I axis_clk1
create_bd_pin -dir I axis_clk2
create_bd_pin -dir I axis_clk3
create_bd_pin -dir I axis_clk4
create_bd_pin -dir I axis_clk5
create_bd_pin -dir I axis_clk6
create_bd_pin -dir I axis_clk7
create_bd_pin -dir I axis_clk8
create_bd_pin -dir I axis_clk9
create_bd_pin -dir I axis_clk10
create_bd_pin -dir I axis_clk11
create_bd_pin -dir I axis_clk12
create_bd_pin -dir I axis_clk13
create_bd_pin -dir I axis_clk14
create_bd_pin -dir I axis_clk15

create_bd_cell -type ip -vlnv xilinx.com:ip:xlslice:1.0 xlslice_0
set_property -dict {CONFIG.DIN_FROM 0 CONFIG.DIN_TO 0 CONFIG.DIN_WIDTH 8} [get_bd_cells xlslice_0]
create_bd_cell -type ip -vlnv xilinx.com:ip:xpm_cdc_gen:1.0 cdc_gpio_dac_ch0
set_property -dict {CONFIG.CDC_TYPE xpm_cdc_single CONFIG.WIDTH 1} [get_bd_cells cdc_gpio_dac_ch0]
create_bd_cell -type ip -vlnv xilinx.com:ip:xlslice:1.0 xlslice_1
set_property -dict {CONFIG.DIN_FROM 0 CONFIG.DIN_TO 0 CONFIG.DIN_WIDTH 8} [get_bd_cells xlslice_1]
create_bd_cell -type ip -vlnv xilinx.com:ip:xpm_cdc_gen:1.0 cdc_gpio_dac_ch1
set_property -dict {CONFIG.CDC_TYPE xpm_cdc_single CONFIG.WIDTH 1} [get_bd_cells cdc_gpio_dac_ch1]
create_bd_cell -type ip -vlnv xilinx.com:ip:xlslice:1.0 xlslice_2
set_property -dict {CONFIG.DIN_FROM 1 CONFIG.DIN_TO 1 CONFIG.DIN_WIDTH 8} [get_bd_cells xlslice_2]
create_bd_cell -type ip -vlnv xilinx.com:ip:xpm_cdc_gen:1.0 cdc_gpio_dac_ch2
set_property -dict {CONFIG.CDC_TYPE xpm_cdc_single CONFIG.WIDTH 1} [get_bd_cells cdc_gpio_dac_ch2]
create_bd_cell -type ip -vlnv xilinx.com:ip:xlslice:1.0 xlslice_3
set_property -dict {CONFIG.DIN_FROM 1 CONFIG.DIN_TO 1 CONFIG.DIN_WIDTH 8} [get_bd_cells xlslice_3]
create_bd_cell -type ip -vlnv xilinx.com:ip:xpm_cdc_gen:1.0 cdc_gpio_dac_ch3
set_property -dict {CONFIG.CDC_TYPE xpm_cdc_single CONFIG.WIDTH 1} [get_bd_cells cdc_gpio_dac_ch3]
create_bd_cell -type ip -vlnv xilinx.com:ip:xlslice:1.0 xlslice_4
set_property -dict {CONFIG.DIN_FROM 2 CONFIG.DIN_TO 2 CONFIG.DIN_WIDTH 8} [get_bd_cells xlslice_4]
create_bd_cell -type ip -vlnv xilinx.com:ip:xpm_cdc_gen:1.0 cdc_gpio_dac_ch4
set_property -dict {CONFIG.CDC_TYPE xpm_cdc_single CONFIG.WIDTH 1} [get_bd_cells cdc_gpio_dac_ch4]
create_bd_cell -type ip -vlnv xilinx.com:ip:xlslice:1.0 xlslice_5
set_property -dict {CONFIG.DIN_FROM 2 CONFIG.DIN_TO 2 CONFIG.DIN_WIDTH 8} [get_bd_cells xlslice_5]
create_bd_cell -type ip -vlnv xilinx.com:ip:xpm_cdc_gen:1.0 cdc_gpio_dac_ch5
set_property -dict {CONFIG.CDC_TYPE xpm_cdc_single CONFIG.WIDTH 1} [get_bd_cells cdc_gpio_dac_ch5]
create_bd_cell -type ip -vlnv xilinx.com:ip:xlslice:1.0 xlslice_6
set_property -dict {CONFIG.DIN_FROM 3 CONFIG.DIN_TO 3 CONFIG.DIN_WIDTH 8} [get_bd_cells xlslice_6]
create_bd_cell -type ip -vlnv xilinx.com:ip:xpm_cdc_gen:1.0 cdc_gpio_dac_ch6
set_property -dict {CONFIG.CDC_TYPE xpm_cdc_single CONFIG.WIDTH 1} [get_bd_cells cdc_gpio_dac_ch6]
create_bd_cell -type ip -vlnv xilinx.com:ip:xlslice:1.0 xlslice_7
set_property -dict {CONFIG.DIN_FROM 3 CONFIG.DIN_TO 3 CONFIG.DIN_WIDTH 8} [get_bd_cells xlslice_7]
create_bd_cell -type ip -vlnv xilinx.com:ip:xpm_cdc_gen:1.0 cdc_gpio_dac_ch7
set_property -dict {CONFIG.CDC_TYPE xpm_cdc_single CONFIG.WIDTH 1} [get_bd_cells cdc_gpio_dac_ch7]
create_bd_cell -type ip -vlnv xilinx.com:ip:xlslice:1.0 xlslice_8
set_property -dict {CONFIG.DIN_FROM 4 CONFIG.DIN_TO 4 CONFIG.DIN_WIDTH 8} [get_bd_cells xlslice_8]
create_bd_cell -type ip -vlnv xilinx.com:ip:xpm_cdc_gen:1.0 cdc_gpio_dac_ch8
set_property -dict {CONFIG.CDC_TYPE xpm_cdc_single CONFIG.WIDTH 1} [get_bd_cells cdc_gpio_dac_ch8]
create_bd_cell -type ip -vlnv xilinx.com:ip:xlslice:1.0 xlslice_9
set_property -dict {CONFIG.DIN_FROM 4 CONFIG.DIN_TO 4 CONFIG.DIN_WIDTH 8} [get_bd_cells xlslice_9]
create_bd_cell -type ip -vlnv xilinx.com:ip:xpm_cdc_gen:1.0 cdc_gpio_dac_ch9
set_property -dict {CONFIG.CDC_TYPE xpm_cdc_single CONFIG.WIDTH 1} [get_bd_cells cdc_gpio_dac_ch9]
create_bd_cell -type ip -vlnv xilinx.com:ip:xlslice:1.0 xlslice_10
set_property -dict {CONFIG.DIN_FROM 5 CONFIG.DIN_TO 5 CONFIG.DIN_WIDTH 8} [get_bd_cells xlslice_10]
create_bd_cell -type ip -vlnv xilinx.com:ip:xpm_cdc_gen:1.0 cdc_gpio_dac_ch10
set_property -dict {CONFIG.CDC_TYPE xpm_cdc_single CONFIG.WIDTH 1} [get_bd_cells cdc_gpio_dac_ch10]
create_bd_cell -type ip -vlnv xilinx.com:ip:xlslice:1.0 xlslice_11
set_property -dict {CONFIG.DIN_FROM 5 CONFIG.DIN_TO 5 CONFIG.DIN_WIDTH 8} [get_bd_cells xlslice_11]
create_bd_cell -type ip -vlnv xilinx.com:ip:xpm_cdc_gen:1.0 cdc_gpio_dac_ch11
set_property -dict {CONFIG.CDC_TYPE xpm_cdc_single CONFIG.WIDTH 1} [get_bd_cells cdc_gpio_dac_ch11]
create_bd_cell -type ip -vlnv xilinx.com:ip:xlslice:1.0 xlslice_12
set_property -dict {CONFIG.DIN_FROM 6 CONFIG.DIN_TO 6 CONFIG.DIN_WIDTH 8} [get_bd_cells xlslice_12]
create_bd_cell -type ip -vlnv xilinx.com:ip:xpm_cdc_gen:1.0 cdc_gpio_dac_ch12
set_property -dict {CONFIG.CDC_TYPE xpm_cdc_single CONFIG.WIDTH 1} [get_bd_cells cdc_gpio_dac_ch12]
create_bd_cell -type ip -vlnv xilinx.com:ip:xlslice:1.0 xlslice_13
set_property -dict {CONFIG.DIN_FROM 6 CONFIG.DIN_TO 6 CONFIG.DIN_WIDTH 8} [get_bd_cells xlslice_13]
create_bd_cell -type ip -vlnv xilinx.com:ip:xpm_cdc_gen:1.0 cdc_gpio_dac_ch13
set_property -dict {CONFIG.CDC_TYPE xpm_cdc_single CONFIG.WIDTH 1} [get_bd_cells cdc_gpio_dac_ch13]
create_bd_cell -type ip -vlnv xilinx.com:ip:xlslice:1.0 xlslice_14
set_property -dict {CONFIG.DIN_FROM 7 CONFIG.DIN_TO 7 CONFIG.DIN_WIDTH 8} [get_bd_cells xlslice_14]
create_bd_cell -type ip -vlnv xilinx.com:ip:xpm_cdc_gen:1.0 cdc_gpio_dac_ch14
set_property -dict {CONFIG.CDC_TYPE xpm_cdc_single CONFIG.WIDTH 1} [get_bd_cells cdc_gpio_dac_ch14]
create_bd_cell -type ip -vlnv xilinx.com:ip:xlslice:1.0 xlslice_15
set_property -dict {CONFIG.DIN_FROM 7 CONFIG.DIN_TO 7 CONFIG.DIN_WIDTH 8} [get_bd_cells xlslice_15]
create_bd_cell -type ip -vlnv xilinx.com:ip:xpm_cdc_gen:1.0 cdc_gpio_dac_ch15
set_property -dict {CONFIG.CDC_TYPE xpm_cdc_single CONFIG.WIDTH 1} [get_bd_cells cdc_gpio_dac_ch15]

# ---- hierarchy /clocking_block ----
current_bd_instance /clocking_block
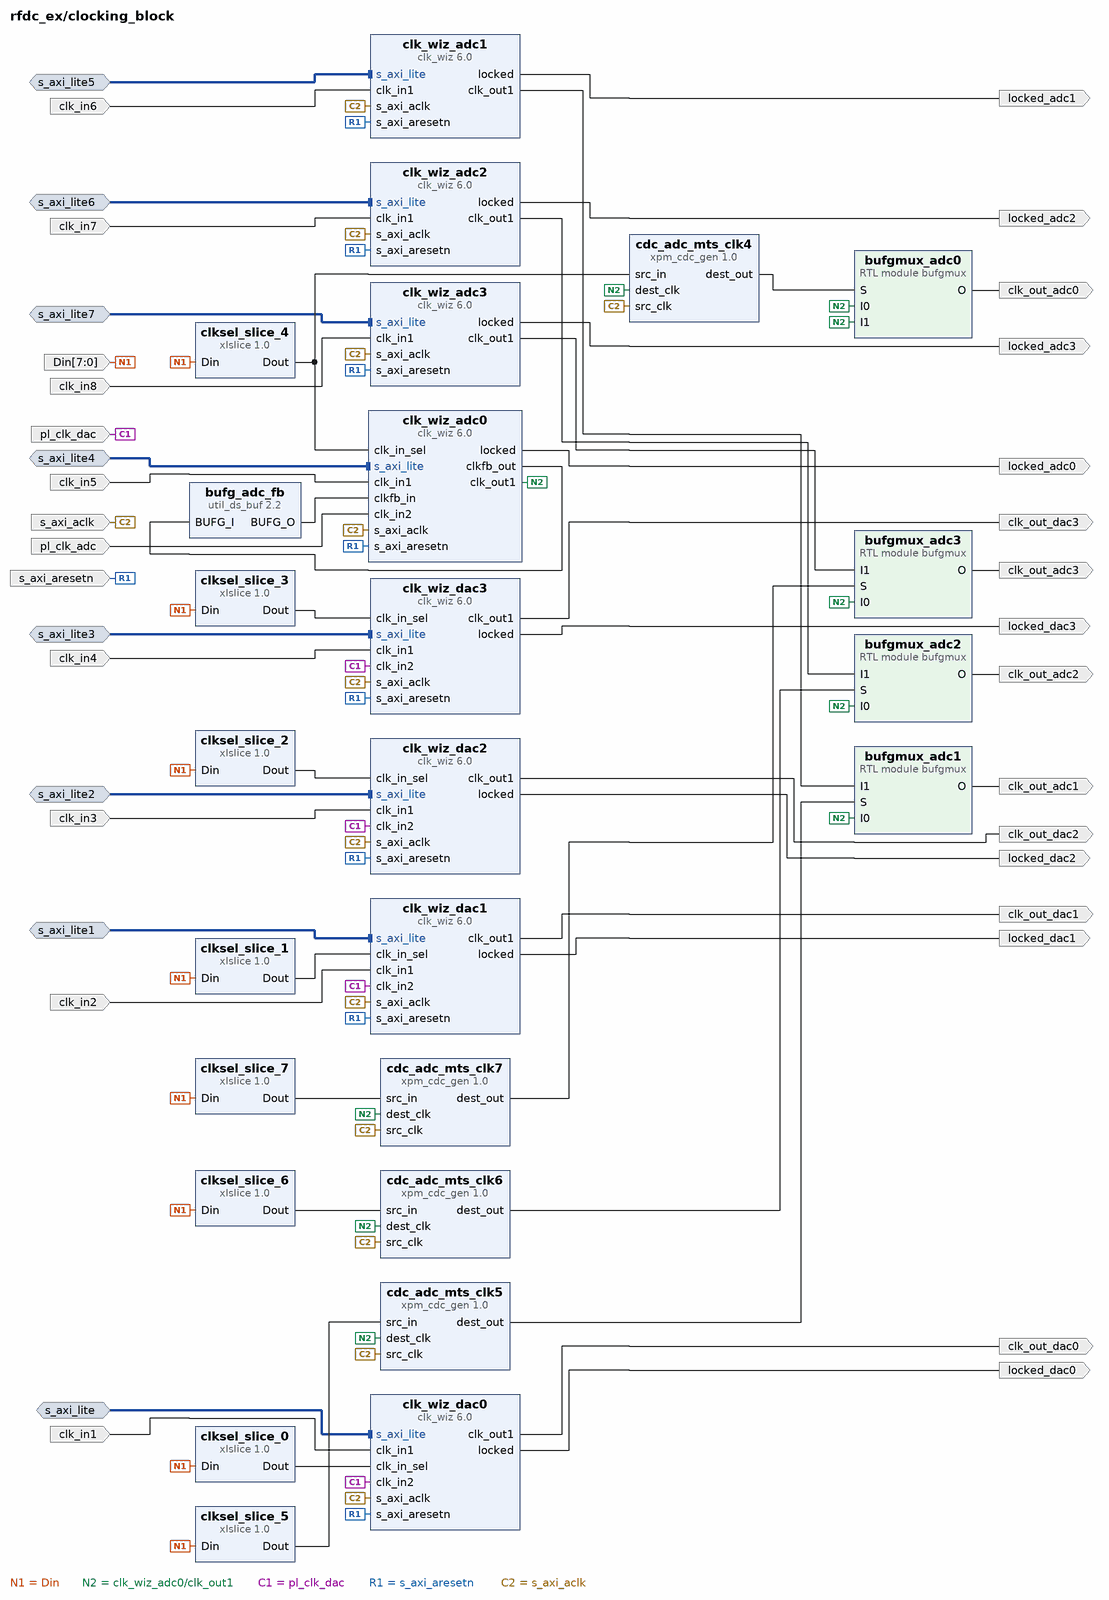
[diagram p3: block diagram inside /clocking_block]
create_bd_intf_pin -mode Slave -vlnv xilinx.com:interface:aximm_rtl:1.0 s_axi_lite
create_bd_intf_pin -mode Slave -vlnv xilinx.com:interface:aximm_rtl:1.0 s_axi_lite1
create_bd_intf_pin -mode Slave -vlnv xilinx.com:interface:aximm_rtl:1.0 s_axi_lite2
create_bd_intf_pin -mode Slave -vlnv xilinx.com:interface:aximm_rtl:1.0 s_axi_lite3
create_bd_intf_pin -mode Slave -vlnv xilinx.com:interface:aximm_rtl:1.0 s_axi_lite4
create_bd_intf_pin -mode Slave -vlnv xilinx.com:interface:aximm_rtl:1.0 s_axi_lite5
create_bd_intf_pin -mode Slave -vlnv xilinx.com:interface:aximm_rtl:1.0 s_axi_lite6
create_bd_intf_pin -mode Slave -vlnv xilinx.com:interface:aximm_rtl:1.0 s_axi_lite7
create_bd_pin -dir I -type clk s_axi_aclk
create_bd_pin -dir I -type rst s_axi_aresetn
create_bd_pin -dir I -type clk clk_in1
create_bd_pin -dir O -type clk clk_out_dac0
create_bd_pin -dir O locked_dac0
create_bd_pin -dir O locked_dac1
create_bd_pin -dir O -type clk clk_out_dac1
create_bd_pin -dir I -type clk clk_in2
create_bd_pin -dir I -type clk clk_in3
create_bd_pin -dir O -type clk clk_out_dac2
create_bd_pin -dir O locked_dac2
create_bd_pin -dir I -type clk clk_in4
create_bd_pin -dir O -type clk clk_out_dac3
create_bd_pin -dir O locked_dac3
create_bd_pin -dir O locked_adc0
create_bd_pin -dir O -type clk clk_out_adc0
create_bd_pin -dir I -type clk clk_in5
create_bd_pin -dir O locked_adc1
create_bd_pin -dir O -type clk clk_out_adc1
create_bd_pin -dir I -type clk clk_in6
create_bd_pin -dir O locked_adc2
create_bd_pin -dir O -type clk clk_out_adc2
create_bd_pin -dir I -type clk clk_in7
create_bd_pin -dir O locked_adc3
create_bd_pin -dir O -type clk clk_out_adc3
create_bd_pin -dir I -type clk clk_in8
create_bd_pin -dir I -type clk pl_clk_dac
create_bd_pin -dir I -from 7 -to 0 Din
create_bd_pin -dir I -type clk pl_clk_adc

create_bd_cell -type ip -vlnv xilinx.com:ip:clk_wiz:6.0 clk_wiz_dac0
set_property -dict [list \
  CONFIG.AXI_DRP false \
  CONFIG.CLKIN1_JITTER_PS 20.339999999999996 \
  CONFIG.CLKIN2_JITTER_PS 20.339999999999996 \
  CONFIG.CLKOUT1_DRIVES BUFG \
  CONFIG.CLKOUT1_JITTER 67.976 \
  CONFIG.CLKOUT1_PHASE_ERROR 64.258 \
  CONFIG.CLKOUT1_REQUESTED_OUT_FREQ 245.76 \
  CONFIG.FEEDBACK_SOURCE FDBK_AUTO \
  CONFIG.JITTER_SEL Min_O_Jitter \
  CONFIG.MMCM_BANDWIDTH HIGH \
  CONFIG.MMCM_CLKFBOUT_MULT_F 3.250 \
  CONFIG.MMCM_CLKIN1_PERIOD 2.034 \
  CONFIG.MMCM_CLKOUT0_DIVIDE_F 6.500 \
  CONFIG.MMCM_DIVCLK_DIVIDE 1 \
  CONFIG.PRIM_IN_FREQ 491.52 \
  CONFIG.PRIM_SOURCE No_buffer \
  CONFIG.SECONDARY_IN_FREQ 491.52 \
  CONFIG.SECONDARY_SOURCE No_buffer \
  CONFIG.USE_DYN_RECONFIG true \
  CONFIG.USE_INCLK_SWITCHOVER true \
  CONFIG.USE_PHASE_ALIGNMENT true \
] [get_bd_cells clk_wiz_dac0]
create_bd_cell -type ip -vlnv xilinx.com:ip:clk_wiz:6.0 clk_wiz_dac1
set_property -dict [list \
  CONFIG.AXI_DRP false \
  CONFIG.CLKIN1_JITTER_PS 20.339999999999996 \
  CONFIG.CLKIN2_JITTER_PS 20.339999999999996 \
  CONFIG.CLKOUT1_DRIVES BUFG \
  CONFIG.CLKOUT1_JITTER 67.976 \
  CONFIG.CLKOUT1_PHASE_ERROR 64.258 \
  CONFIG.CLKOUT1_REQUESTED_OUT_FREQ 245.76 \
  CONFIG.FEEDBACK_SOURCE FDBK_AUTO \
  CONFIG.JITTER_SEL Min_O_Jitter \
  CONFIG.MMCM_BANDWIDTH HIGH \
  CONFIG.MMCM_CLKFBOUT_MULT_F 3.250 \
  CONFIG.MMCM_CLKIN1_PERIOD 2.034 \
  CONFIG.MMCM_CLKOUT0_DIVIDE_F 6.500 \
  CONFIG.MMCM_DIVCLK_DIVIDE 1 \
  CONFIG.PRIM_IN_FREQ 491.52 \
  CONFIG.PRIM_SOURCE No_buffer \
  CONFIG.SECONDARY_IN_FREQ 491.52 \
  CONFIG.SECONDARY_SOURCE No_buffer \
  CONFIG.USE_DYN_RECONFIG true \
  CONFIG.USE_INCLK_SWITCHOVER true \
  CONFIG.USE_PHASE_ALIGNMENT true \
] [get_bd_cells clk_wiz_dac1]
create_bd_cell -type ip -vlnv xilinx.com:ip:clk_wiz:6.0 clk_wiz_dac2
set_property -dict [list \
  CONFIG.AXI_DRP false \
  CONFIG.CLKIN1_JITTER_PS 20.339999999999996 \
  CONFIG.CLKIN2_JITTER_PS 20.339999999999996 \
  CONFIG.CLKOUT1_DRIVES BUFG \
  CONFIG.CLKOUT1_JITTER 67.976 \
  CONFIG.CLKOUT1_PHASE_ERROR 64.258 \
  CONFIG.CLKOUT1_REQUESTED_OUT_FREQ 245.76 \
  CONFIG.FEEDBACK_SOURCE FDBK_AUTO \
  CONFIG.JITTER_SEL Min_O_Jitter \
  CONFIG.MMCM_BANDWIDTH HIGH \
  CONFIG.MMCM_CLKFBOUT_MULT_F 3.250 \
  CONFIG.MMCM_CLKIN1_PERIOD 2.034 \
  CONFIG.MMCM_CLKOUT0_DIVIDE_F 6.500 \
  CONFIG.MMCM_DIVCLK_DIVIDE 1 \
  CONFIG.PRIM_IN_FREQ 491.52 \
  CONFIG.PRIM_SOURCE No_buffer \
  CONFIG.SECONDARY_IN_FREQ 491.52 \
  CONFIG.SECONDARY_SOURCE No_buffer \
  CONFIG.USE_DYN_RECONFIG true \
  CONFIG.USE_INCLK_SWITCHOVER true \
  CONFIG.USE_PHASE_ALIGNMENT true \
] [get_bd_cells clk_wiz_dac2]
create_bd_cell -type ip -vlnv xilinx.com:ip:clk_wiz:6.0 clk_wiz_dac3
set_property -dict [list \
  CONFIG.AXI_DRP false \
  CONFIG.CLKIN1_JITTER_PS 20.339999999999996 \
  CONFIG.CLKIN2_JITTER_PS 20.339999999999996 \
  CONFIG.CLKOUT1_DRIVES BUFG \
  CONFIG.CLKOUT1_JITTER 67.976 \
  CONFIG.CLKOUT1_PHASE_ERROR 64.258 \
  CONFIG.CLKOUT1_REQUESTED_OUT_FREQ 245.76 \
  CONFIG.FEEDBACK_SOURCE FDBK_AUTO \
  CONFIG.JITTER_SEL Min_O_Jitter \
  CONFIG.MMCM_BANDWIDTH HIGH \
  CONFIG.MMCM_CLKFBOUT_MULT_F 3.250 \
  CONFIG.MMCM_CLKIN1_PERIOD 2.034 \
  CONFIG.MMCM_CLKOUT0_DIVIDE_F 6.500 \
  CONFIG.MMCM_DIVCLK_DIVIDE 1 \
  CONFIG.PRIM_IN_FREQ 491.52 \
  CONFIG.PRIM_SOURCE No_buffer \
  CONFIG.SECONDARY_IN_FREQ 491.52 \
  CONFIG.SECONDARY_SOURCE No_buffer \
  CONFIG.USE_DYN_RECONFIG true \
  CONFIG.USE_INCLK_SWITCHOVER true \
  CONFIG.USE_PHASE_ALIGNMENT true \
] [get_bd_cells clk_wiz_dac3]
create_bd_cell -type ip -vlnv xilinx.com:ip:clk_wiz:6.0 clk_wiz_adc0
set_property -dict [list \
  CONFIG.AXI_DRP false \
  CONFIG.CLKIN1_JITTER_PS 36.160000000000004 \
  CONFIG.CLKIN2_JITTER_PS 36.160000000000004 \
  CONFIG.CLKOUT1_DRIVES No_buffer \
  CONFIG.CLKOUT1_JITTER 72.461 \
  CONFIG.CLKOUT1_PHASE_ERROR 88.322 \
  CONFIG.CLKOUT1_REQUESTED_OUT_FREQ 368.64 \
  CONFIG.FEEDBACK_SOURCE FDBK_ONCHIP \
  CONFIG.JITTER_SEL Min_O_Jitter \
  CONFIG.MMCM_BANDWIDTH HIGH \
  CONFIG.MMCM_CLKFBOUT_MULT_F 17.000 \
  CONFIG.MMCM_CLKIN1_PERIOD 3.617 \
  CONFIG.MMCM_CLKOUT0_DIVIDE_F 4.250 \
  CONFIG.PRIM_IN_FREQ 276.48 \
  CONFIG.PRIM_SOURCE No_buffer \
  CONFIG.SECONDARY_IN_FREQ 276.48 \
  CONFIG.SECONDARY_SOURCE No_buffer \
  CONFIG.USE_DYN_RECONFIG true \
  CONFIG.USE_INCLK_SWITCHOVER true \
  CONFIG.USE_PHASE_ALIGNMENT true \
] [get_bd_cells clk_wiz_adc0]
create_bd_cell -type ip -vlnv xilinx.com:ip:clk_wiz:6.0 clk_wiz_adc1
set_property -dict [list \
  CONFIG.AXI_DRP false \
  CONFIG.CLKIN1_JITTER_PS 36.160000000000004 \
  CONFIG.CLKOUT1_DRIVES No_buffer \
  CONFIG.CLKOUT1_JITTER 76.550 \
  CONFIG.CLKOUT1_PHASE_ERROR 83.786 \
  CONFIG.CLKOUT1_REQUESTED_OUT_FREQ 368.64 \
  CONFIG.FEEDBACK_SOURCE FDBK_ONCHIP \
  CONFIG.JITTER_SEL Min_O_Jitter \
  CONFIG.MMCM_BANDWIDTH HIGH \
  CONFIG.MMCM_CLKFBOUT_MULT_F 16 \
  CONFIG.MMCM_CLKIN1_PERIOD 3.617 \
  CONFIG.MMCM_CLKOUT0_DIVIDE_F 4 \
  CONFIG.MMCM_COMPENSATION AUTO \
  CONFIG.PRIMITIVE PLL \
  CONFIG.PRIM_IN_FREQ 276.48 \
  CONFIG.PRIM_SOURCE No_buffer \
  CONFIG.USE_DYN_RECONFIG true \
  CONFIG.USE_PHASE_ALIGNMENT false \
] [get_bd_cells clk_wiz_adc1]
create_bd_cell -type ip -vlnv xilinx.com:ip:clk_wiz:6.0 clk_wiz_adc2
set_property -dict [list \
  CONFIG.AXI_DRP false \
  CONFIG.CLKIN1_JITTER_PS 36.160000000000004 \
  CONFIG.CLKOUT1_DRIVES No_buffer \
  CONFIG.CLKOUT1_JITTER 76.550 \
  CONFIG.CLKOUT1_PHASE_ERROR 83.786 \
  CONFIG.CLKOUT1_REQUESTED_OUT_FREQ 368.64 \
  CONFIG.FEEDBACK_SOURCE FDBK_ONCHIP \
  CONFIG.JITTER_SEL Min_O_Jitter \
  CONFIG.MMCM_BANDWIDTH HIGH \
  CONFIG.MMCM_CLKFBOUT_MULT_F 16 \
  CONFIG.MMCM_CLKIN1_PERIOD 3.617 \
  CONFIG.MMCM_CLKOUT0_DIVIDE_F 4 \
  CONFIG.MMCM_COMPENSATION AUTO \
  CONFIG.PRIMITIVE PLL \
  CONFIG.PRIM_IN_FREQ 276.48 \
  CONFIG.PRIM_SOURCE No_buffer \
  CONFIG.USE_DYN_RECONFIG true \
  CONFIG.USE_PHASE_ALIGNMENT false \
] [get_bd_cells clk_wiz_adc2]
create_bd_cell -type ip -vlnv xilinx.com:ip:clk_wiz:6.0 clk_wiz_adc3
set_property -dict [list \
  CONFIG.AXI_DRP false \
  CONFIG.CLKIN1_JITTER_PS 36.160000000000004 \
  CONFIG.CLKOUT1_DRIVES No_buffer \
  CONFIG.CLKOUT1_JITTER 76.550 \
  CONFIG.CLKOUT1_PHASE_ERROR 83.786 \
  CONFIG.CLKOUT1_REQUESTED_OUT_FREQ 368.64 \
  CONFIG.FEEDBACK_SOURCE FDBK_ONCHIP \
  CONFIG.JITTER_SEL Min_O_Jitter \
  CONFIG.MMCM_BANDWIDTH HIGH \
  CONFIG.MMCM_CLKFBOUT_MULT_F 16 \
  CONFIG.MMCM_CLKIN1_PERIOD 3.617 \
  CONFIG.MMCM_CLKOUT0_DIVIDE_F 4 \
  CONFIG.MMCM_COMPENSATION AUTO \
  CONFIG.PRIMITIVE PLL \
  CONFIG.PRIM_IN_FREQ 276.48 \
  CONFIG.PRIM_SOURCE No_buffer \
  CONFIG.USE_DYN_RECONFIG true \
  CONFIG.USE_PHASE_ALIGNMENT false \
] [get_bd_cells clk_wiz_adc3]
create_bd_cell -type ip -vlnv xilinx.com:ip:xlslice:1.0 clksel_slice_0
set_property -dict {CONFIG.DIN_FROM 0 CONFIG.DIN_TO 0 CONFIG.DIN_WIDTH 8 CONFIG.DOUT_WIDTH 1} [get_bd_cells clksel_slice_0]
create_bd_cell -type ip -vlnv xilinx.com:ip:xlslice:1.0 clksel_slice_1
set_property -dict {CONFIG.DIN_FROM 1 CONFIG.DIN_TO 1 CONFIG.DIN_WIDTH 8 CONFIG.DOUT_WIDTH 1} [get_bd_cells clksel_slice_1]
create_bd_cell -type ip -vlnv xilinx.com:ip:xlslice:1.0 clksel_slice_2
set_property -dict {CONFIG.DIN_FROM 2 CONFIG.DIN_TO 2 CONFIG.DIN_WIDTH 8 CONFIG.DOUT_WIDTH 1} [get_bd_cells clksel_slice_2]
create_bd_cell -type ip -vlnv xilinx.com:ip:xlslice:1.0 clksel_slice_3
set_property -dict {CONFIG.DIN_FROM 3 CONFIG.DIN_TO 3 CONFIG.DIN_WIDTH 8 CONFIG.DOUT_WIDTH 1} [get_bd_cells clksel_slice_3]
create_bd_cell -type module -reference bufgmux bufgmux_adc0
create_bd_cell -type module -reference bufgmux bufgmux_adc1
create_bd_cell -type module -reference bufgmux bufgmux_adc2
create_bd_cell -type module -reference bufgmux bufgmux_adc3
create_bd_cell -type ip -vlnv xilinx.com:ip:util_ds_buf:2.2 bufg_adc_fb
set_property -dict {CONFIG.C_BUF_TYPE BUFG} [get_bd_cells bufg_adc_fb]
create_bd_cell -type ip -vlnv xilinx.com:ip:xlslice:1.0 clksel_slice_4
set_property -dict {CONFIG.DIN_FROM 4 CONFIG.DIN_TO 4 CONFIG.DIN_WIDTH 8 CONFIG.DOUT_WIDTH 1} [get_bd_cells clksel_slice_4]
create_bd_cell -type ip -vlnv xilinx.com:ip:xpm_cdc_gen:1.0 cdc_adc_mts_clk4
set_property -dict {CONFIG.CDC_TYPE xpm_cdc_single CONFIG.WIDTH 1} [get_bd_cells cdc_adc_mts_clk4]
create_bd_cell -type ip -vlnv xilinx.com:ip:xlslice:1.0 clksel_slice_5
set_property -dict {CONFIG.DIN_FROM 5 CONFIG.DIN_TO 5 CONFIG.DIN_WIDTH 8 CONFIG.DOUT_WIDTH 1} [get_bd_cells clksel_slice_5]
create_bd_cell -type ip -vlnv xilinx.com:ip:xpm_cdc_gen:1.0 cdc_adc_mts_clk5
set_property -dict {CONFIG.CDC_TYPE xpm_cdc_single CONFIG.WIDTH 1} [get_bd_cells cdc_adc_mts_clk5]
create_bd_cell -type ip -vlnv xilinx.com:ip:xlslice:1.0 clksel_slice_6
set_property -dict {CONFIG.DIN_FROM 6 CONFIG.DIN_TO 6 CONFIG.DIN_WIDTH 8 CONFIG.DOUT_WIDTH 1} [get_bd_cells clksel_slice_6]
create_bd_cell -type ip -vlnv xilinx.com:ip:xpm_cdc_gen:1.0 cdc_adc_mts_clk6
set_property -dict {CONFIG.CDC_TYPE xpm_cdc_single CONFIG.WIDTH 1} [get_bd_cells cdc_adc_mts_clk6]
create_bd_cell -type ip -vlnv xilinx.com:ip:xlslice:1.0 clksel_slice_7
set_property -dict {CONFIG.DIN_FROM 7 CONFIG.DIN_TO 7 CONFIG.DIN_WIDTH 8 CONFIG.DOUT_WIDTH 1} [get_bd_cells clksel_slice_7]
create_bd_cell -type ip -vlnv xilinx.com:ip:xpm_cdc_gen:1.0 cdc_adc_mts_clk7
set_property -dict {CONFIG.CDC_TYPE xpm_cdc_single CONFIG.WIDTH 1} [get_bd_cells cdc_adc_mts_clk7]
